# Altium schematic sheet STM32F429.SchDoc: 基于蓝牙RSSI的智能跟随机器人电路原理图
size A4; Date: 2018年3月4日; Author: 田宝宁 陈世萍 郭琳  孟祥龙 于群; Organization: 华北电力大学
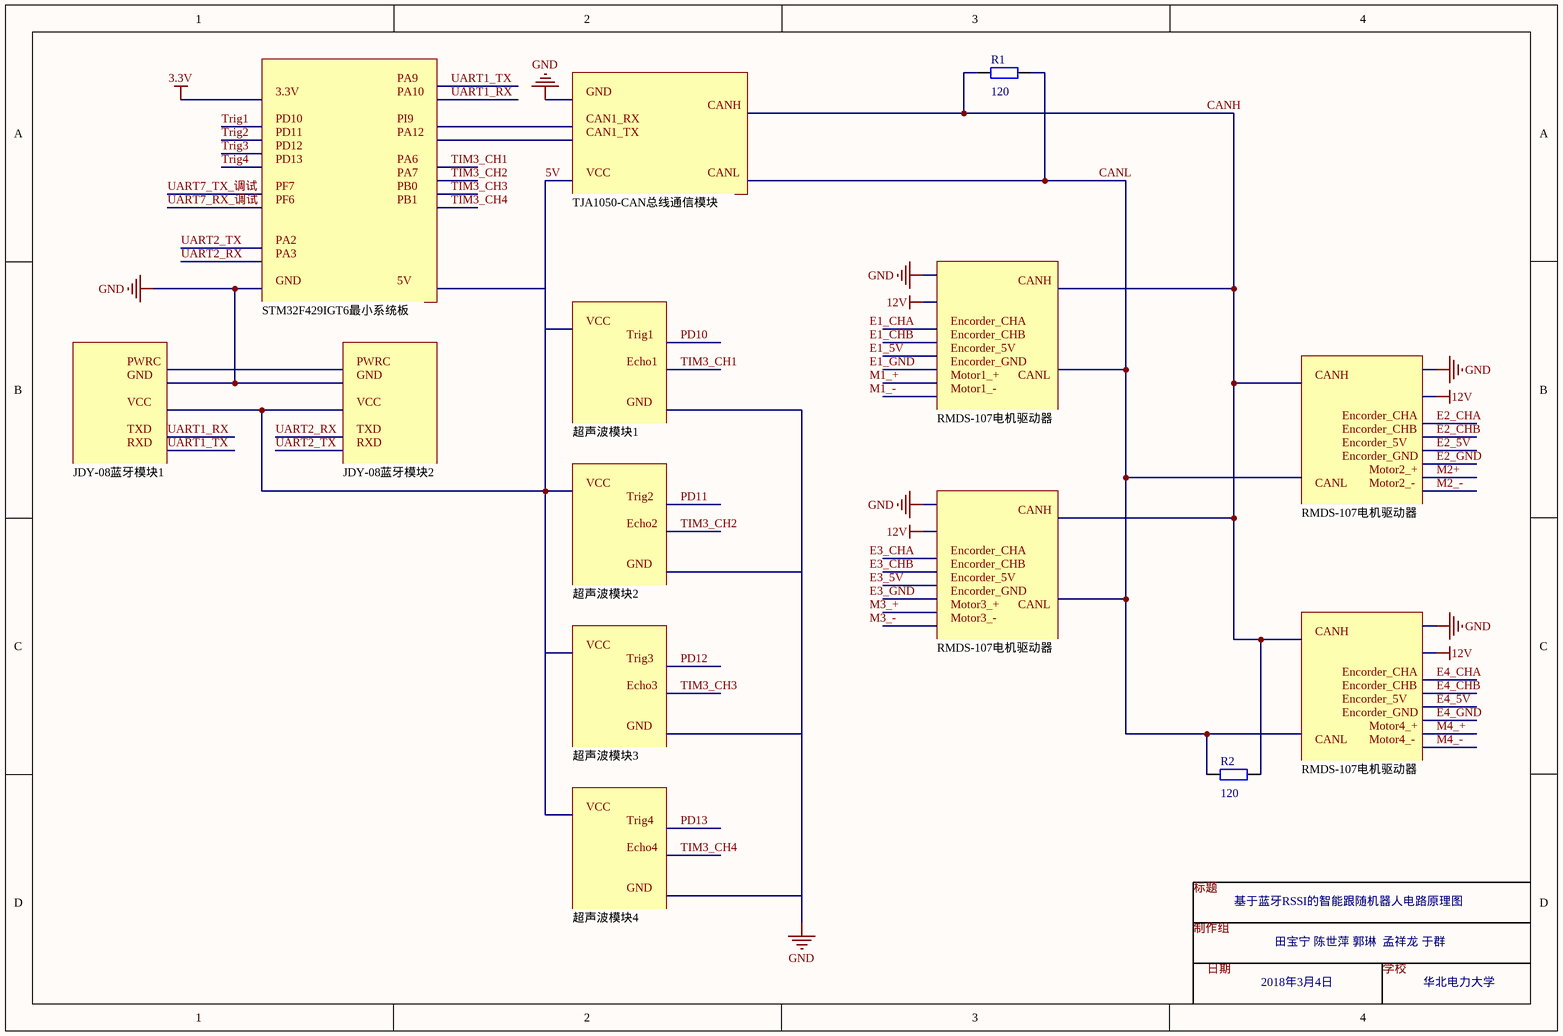
[diagram p0: STM32F429.SchDoc]

## Parts
R1  value 120  [AXIAL-0.4]
R2  value 120  [AXIAL-0.4]

## Nets
CANH: R1.1
CANL: R1.2

Not connected (* = marked no-connect by the designer): R2 1 2

## Notes on the sheet
- TJA1050-CAN总线通信模块
- STM32F429IGT6最小系统板
- 超声波模块1
- RMDS-107电机驱动器
- JDY-08蓝牙模块1
- JDY-08蓝牙模块2
- 超声波模块2
- 超声波模块3
- 超声波模块4
- Labels drawn without touching a wire or pin: 3.3V, 5V, CAN1_RX, CAN1_TX, CANH, CANL, E1_5V, E1_CHA, E1_CHB, E1_GND, E3_5V, E3_CHA, E3_CHB, E3_GND, Echo1, Echo2, Echo3, Echo4, Encorder_5V, Encorder_CHA, Encorder_CHB, Encorder_GND, GND, M1_+, M1_-, M3_+, M3_-, Motor1_+, Motor1_-, Motor2_+, Motor2_-, Motor3_+, Motor3_-, Motor4_+, Motor4_-, PA2, PA3, PA6, PA7, PA9, PA10, PA12, PB0, PB1, PD10, PD11, PD12, PD13, PF6, PF7, PI9, PWRC, RXD, Trig1, Trig2, Trig3, Trig4, TXD, VCC, 制作组, 学校, 日期, 标题

## Library data of the parts
R1 R2 = Res2: Resistor; Published: 8-Jun-2000; LatestRevisionDate: 17-Jul-2002; LatestRevisionNote: Re-released for DXP Platform.; PackageReference: AXIAL-0.4; Publisher: Altium Limited; PackageDescription: Axial Device, Thru-Hole; 2 Leads; 0.4 in Pin Spacing